# EasyEDA schematic schema.json
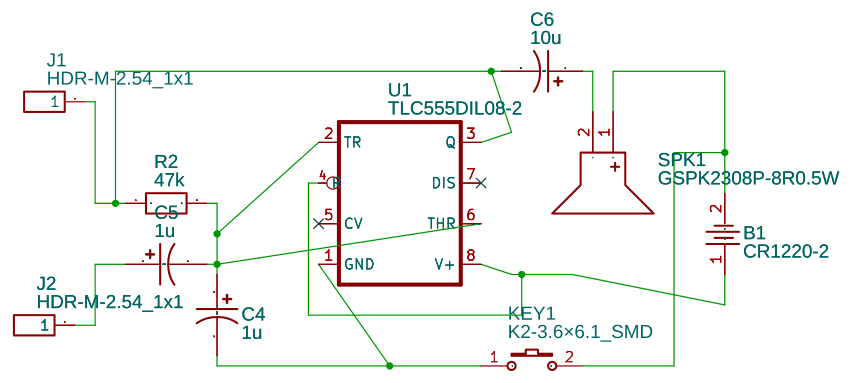
[diagram p0: schematic sheet]

## Parts
B1  CR1220-2  [BAT-SMD_CR1220-2]
C4  1u  [CASE-A_3216]
C5  1u  [CASE-A_3216]
C6  10u  [CASE-A_3216]
J1  HDR-M-2.54_1x1  [HDR-M-2.54_1X1]
J2  HDR-M-2.54_1x1  [HDR-M-2.54_1X1]
KEY1  K2-3.6×6.1_SMD  [KEY-SMD_2P-L6.2-W3.6-LS8.0]
R2  47k  [R0603]
SPK1  GSPK2308P-8R0.5W  [SPK-TH_BD23.0-P10.00-D0.8-L-RD]
U1  TLC555DIL08-2  [DIL08-2]

## Library data of the parts
B1 = CR1220-2: Supplier: LCSC; Manufacturer: Q&J; image: //image.lceda.cn/szlcsc/C70381.jpg; Supplier Part: C70381
C4-C6 = C_Tan_SMD_A_US: Contributor: LCEDA_Lib
J1 J2 = HDR-M-2.54_1x1: Supplier Part: C81276; Supplier: LCSC; Contributor: LCEDA_Lib
KEY1 = K2-3.6×6.1_SMD: Supplier Part: C118141; Supplier: LCSC; Manufacturer Part: K2-1107ST-A4SW-06; Contributor: LCEDA_Lib; 制造商: 韩国韩荣
R2 = R_0603_EU: Contributor: LCEDA_Lib
SPK1 = GSPK2308P-8R0.5W: Contributor: LCSC; Supplier: LCSC; Supplier Part: C530532; Manufacturer: INGHAi(赢海); JLCPCB Part Class: Extended Part
U1 = TLC555DIL08-2

## Nets
Net-(B1-1): B1.1 U1.4(R) U1.8(V+)
Net-(B1-2): B1.2 KEY1.2 SPK1.1(+)
Net-(C4-1): C4.1 C5.2 R2.2 U1.2(TR) U1.6(THR)
Net-(C4-2): C4.2 KEY1.1 U1.1(GND)
Net-(C5-1): C5.1 J2.1
Net-(C6-1): C6.1 SPK1.2(-)
Net-(C6-2): C6.2 J1.1 R2.1 U1.3(Q)

Not connected (* = marked no-connect by the designer): U1 5(CV)* 7(DIS)*

## Notes on the sheet
- 1
- 2
- 3
- 4
- 5
- 6
- A
- A
- B
- B
- C
- C
- Schematic1
- Update Date
- 2024-05-14
- Schematic
- Create Date
- 2024-05-15
- Page
- P1
- Part Number
- JLCPCB-002
- Drawn
- EasyEDA
- Reviewed
- EasyEDA
- metal detector
- D
- D
- VER
- SIZE
- 1
- 1
- PAGE
- OF
- V0.1
- A4
- EasyEDA.com
- 1
- 2
- 3
- 4
- 5
- 6
